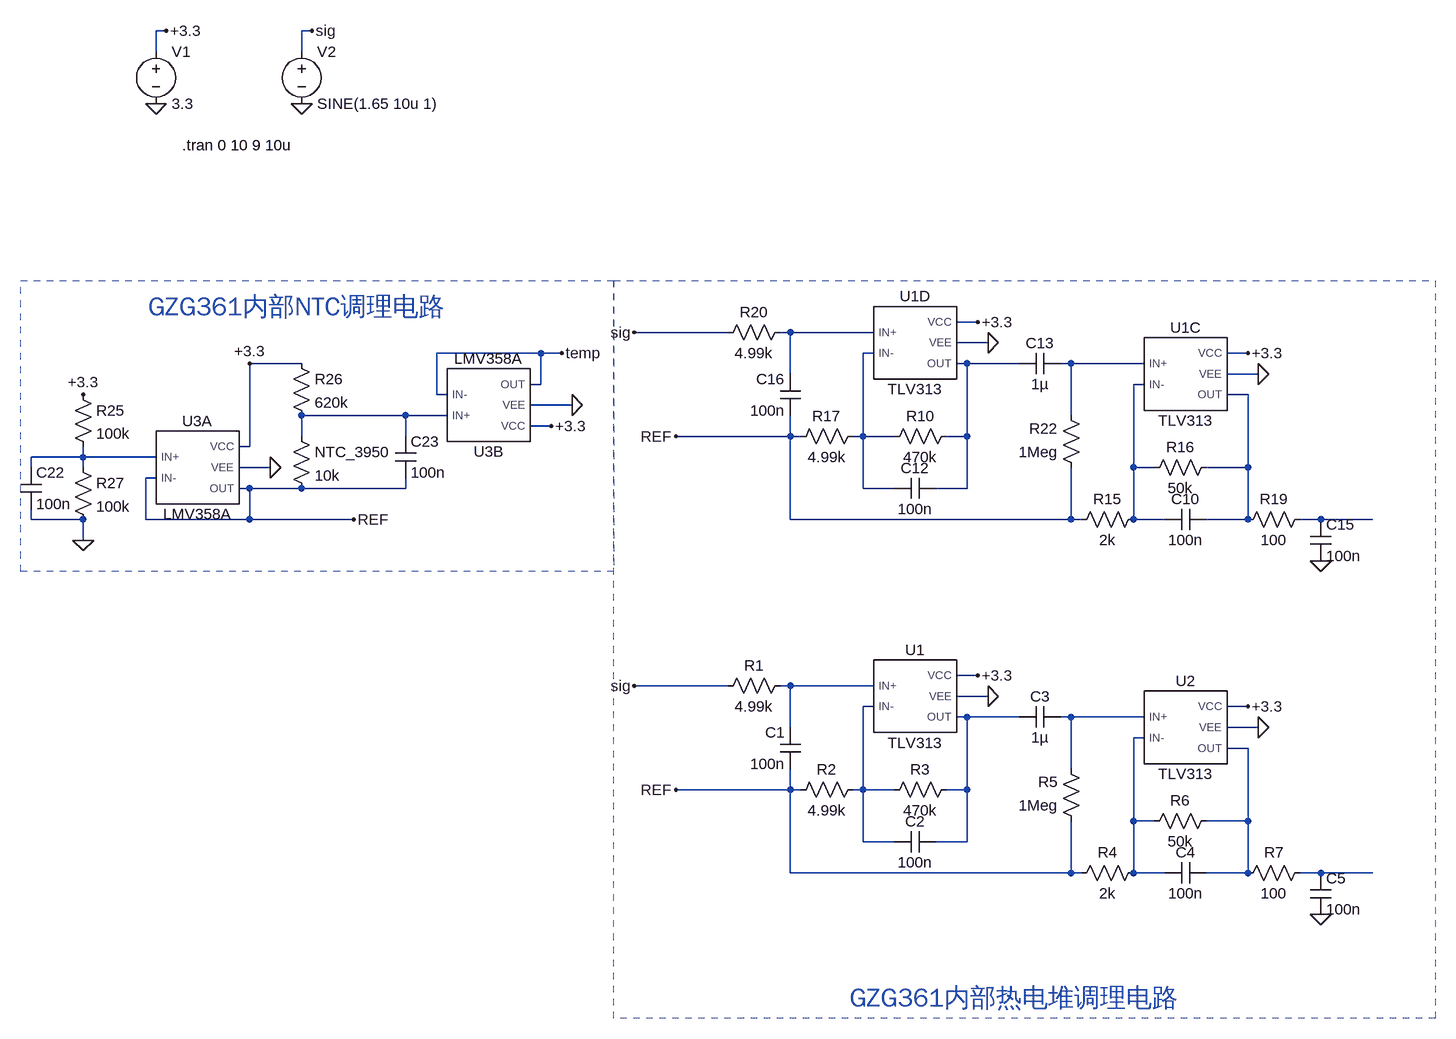
[diagram p0: schematic GZG361调理电路.asc]
GZG361调理电路.asc, the LTspice schematic file:
Version 4.1
SHEET 1 1588 1476
WIRE -384 -304 -400 -304
WIRE -160 -304 -176 -304
WIRE -400 -272 -400 -304
WIRE -176 -272 -176 -304
WIRE 864 144 832 144
WIRE 480 160 336 160
WIRE 576 160 560 160
WIRE 704 160 576 160
WIRE 880 176 832 176
WIRE 192 192 32 192
WIRE 224 192 192 192
WIRE 704 192 688 192
WIRE 1280 192 1248 192
WIRE -176 208 -256 208
WIRE 848 208 832 208
WIRE 928 208 848 208
WIRE 1008 208 992 208
WIRE 1120 208 1008 208
WIRE 576 224 576 160
WIRE 1296 224 1248 224
WIRE 192 240 192 192
WIRE 192 240 176 240
WIRE 1120 240 1104 240
WIRE 32 256 32 192
WIRE 48 256 32 256
WIRE 1280 256 1248 256
WIRE 240 272 176 272
WIRE -16 288 -176 288
WIRE 48 288 -16 288
WIRE 1008 288 1008 208
WIRE 208 304 176 304
WIRE -176 320 -176 288
WIRE -16 320 -16 288
WIRE 576 320 576 288
WIRE 576 320 400 320
WIRE 592 320 576 320
WIRE 688 320 688 192
WIRE 688 320 672 320
WIRE 736 320 688 320
WIRE 848 320 848 208
WIRE 848 320 816 320
WIRE -256 336 -256 208
WIRE -256 336 -272 336
WIRE -512 352 -512 336
WIRE -512 352 -592 352
WIRE -400 352 -512 352
WIRE -592 368 -592 352
WIRE -512 368 -512 352
WIRE -224 368 -272 368
WIRE 1104 368 1104 240
WIRE 1136 368 1104 368
WIRE 1280 368 1280 256
WIRE 1280 368 1216 368
WIRE -400 384 -416 384
WIRE -256 400 -272 400
WIRE -176 400 -256 400
WIRE -16 400 -16 384
WIRE -16 400 -176 400
WIRE 688 400 688 320
WIRE 736 400 688 400
WIRE 848 400 848 320
WIRE 848 400 800 400
WIRE -592 448 -592 432
WIRE -512 448 -592 448
WIRE -416 448 -416 384
WIRE -256 448 -256 400
WIRE -256 448 -416 448
WIRE -96 448 -256 448
WIRE 576 448 576 320
WIRE 1008 448 1008 368
WIRE 1008 448 576 448
WIRE 1024 448 1008 448
WIRE 1104 448 1104 368
WIRE 1152 448 1104 448
WIRE 1280 448 1280 368
WIRE 1280 448 1216 448
WIRE 1392 448 1360 448
WIRE 1472 448 1392 448
WIRE -512 480 -512 448
WIRE 864 688 832 688
WIRE 480 704 336 704
WIRE 576 704 560 704
WIRE 704 704 576 704
WIRE 880 720 832 720
WIRE 704 736 688 736
WIRE 1280 736 1248 736
WIRE 848 752 832 752
WIRE 928 752 848 752
WIRE 1008 752 992 752
WIRE 1120 752 1008 752
WIRE 576 768 576 704
WIRE 1296 768 1248 768
WIRE 1120 784 1104 784
WIRE 1280 800 1248 800
WIRE 1008 832 1008 752
WIRE 576 864 576 832
WIRE 576 864 400 864
WIRE 592 864 576 864
WIRE 688 864 688 736
WIRE 688 864 672 864
WIRE 736 864 688 864
WIRE 848 864 848 752
WIRE 848 864 816 864
WIRE 1104 912 1104 784
WIRE 1136 912 1104 912
WIRE 1280 912 1280 800
WIRE 1280 912 1216 912
WIRE 688 944 688 864
WIRE 736 944 688 944
WIRE 848 944 848 864
WIRE 848 944 800 944
WIRE 576 992 576 864
WIRE 1008 992 1008 912
WIRE 1008 992 576 992
WIRE 1024 992 1008 992
WIRE 1104 992 1104 912
WIRE 1152 992 1104 992
WIRE 1280 992 1280 912
WIRE 1280 992 1216 992
WIRE 1392 992 1360 992
WIRE 1472 992 1392 992
FLAG -512 480 0
FLAG -400 -192 0
FLAG -384 -304 +3.3
FLAG -512 256 +3.3
FLAG -224 368 0
FLAG 224 192 temp
FLAG 208 304 +3.3
FLAG 240 272 0
FLAG -256 208 +3.3
FLAG 864 144 +3.3
FLAG 880 176 0
FLAG 1280 192 +3.3
FLAG 1296 224 0
FLAG 1392 512 0
FLAG -96 448 REF
FLAG 400 320 REF
FLAG -176 -192 0
FLAG -160 -304 sig
FLAG 336 160 sig
FLAG 864 688 +3.3
FLAG 880 720 0
FLAG 1280 736 +3.3
FLAG 1296 768 0
FLAG 1392 1056 0
FLAG 400 864 REF
FLAG 336 704 sig
DATAFLAG -176 448 ""
DATAFLAG -48 288 ""
SYMBOL res -192 192 R0
SYMATTR InstName R26
SYMATTR Value 620k
SYMBOL cap -32 320 R0
SYMATTR InstName C23
SYMATTR Value 100n
SYMBOL res -528 240 R0
SYMATTR InstName R25
SYMATTR Value 100k
SYMBOL res -528 352 R0
SYMATTR InstName R27
SYMATTR Value 100k
SYMBOL cap -608 368 R0
SYMATTR InstName C22
SYMATTR Value 100n
SYMBOL voltage -400 -288 R0
WINDOW 123 0 0 Left 0
WINDOW 39 0 0 Left 0
SYMATTR InstName V1
SYMATTR Value 3.3
SYMBOL res -192 304 R0
SYMATTR InstName NTC_3950
SYMATTR Value 10k
SYMBOL LMV358A -336 368 R0
SYMATTR InstName U3A
SYMBOL LMV358A 112 272 M180
SYMATTR InstName U3B
SYMBOL TLV313 768 176 R0
SYMATTR InstName U1D
SYMBOL res 576 144 R90
WINDOW 0 0 56 VBottom 2
WINDOW 3 32 56 VTop 2
SYMATTR InstName R20
SYMATTR Value 4.99k
SYMBOL cap 592 288 R180
WINDOW 0 24 56 Left 2
WINDOW 3 24 8 Left 2
SYMATTR InstName C16
SYMATTR Value 100n
SYMBOL res 688 304 R90
WINDOW 0 0 56 VBottom 2
WINDOW 3 32 56 VTop 2
SYMATTR InstName R17
SYMATTR Value 4.99k
SYMBOL cap 800 384 R90
WINDOW 0 0 32 VBottom 2
WINDOW 3 32 32 VTop 2
SYMATTR InstName C12
SYMATTR Value 100n
SYMBOL res 832 304 R90
WINDOW 0 0 56 VBottom 2
WINDOW 3 32 56 VTop 2
SYMATTR InstName R10
SYMATTR Value 470k
SYMBOL TLV313 1184 224 R0
SYMATTR InstName U1C
SYMBOL cap 992 192 R90
WINDOW 0 0 32 VBottom 2
WINDOW 3 32 32 VTop 2
SYMATTR InstName C13
SYMATTR Value 1µ
SYMBOL res 1008 464 R270
WINDOW 0 32 56 VTop 2
WINDOW 3 0 56 VBottom 2
SYMATTR InstName R15
SYMATTR Value 2k
SYMBOL res 1024 384 R180
WINDOW 0 36 76 Left 2
WINDOW 3 36 40 Left 2
SYMATTR InstName R22
SYMATTR Value 1Meg
SYMBOL res 1120 384 R270
WINDOW 0 32 56 VTop 2
WINDOW 3 0 56 VBottom 2
SYMATTR InstName R16
SYMATTR Value 50k
SYMBOL cap 1152 464 R270
WINDOW 0 32 32 VTop 2
WINDOW 3 0 32 VBottom 2
SYMATTR InstName C10
SYMATTR Value 100n
SYMBOL res 1264 464 R270
WINDOW 0 32 56 VTop 2
WINDOW 3 0 56 VBottom 2
SYMATTR InstName R19
SYMATTR Value 100
SYMBOL cap 1376 448 R0
SYMATTR InstName C15
SYMATTR Value 100n
SYMBOL voltage -176 -288 R0
WINDOW 123 0 0 Left 0
WINDOW 39 0 0 Left 0
SYMATTR InstName V2
SYMATTR Value SINE(1.65 10u 1)
SYMBOL TLV313 768 720 R0
SYMATTR InstName U1
SYMBOL res 576 688 R90
WINDOW 0 0 56 VBottom 2
WINDOW 3 32 56 VTop 2
SYMATTR InstName R1
SYMATTR Value 4.99k
SYMBOL cap 592 832 R180
WINDOW 0 24 56 Left 2
WINDOW 3 24 8 Left 2
SYMATTR InstName C1
SYMATTR Value 100n
SYMBOL res 688 848 R90
WINDOW 0 0 56 VBottom 2
WINDOW 3 32 56 VTop 2
SYMATTR InstName R2
SYMATTR Value 4.99k
SYMBOL cap 800 928 R90
WINDOW 0 0 32 VBottom 2
WINDOW 3 32 32 VTop 2
SYMATTR InstName C2
SYMATTR Value 100n
SYMBOL res 832 848 R90
WINDOW 0 0 56 VBottom 2
WINDOW 3 32 56 VTop 2
SYMATTR InstName R3
SYMATTR Value 470k
SYMBOL TLV313 1184 768 R0
SYMATTR InstName U2
SYMBOL cap 992 736 R90
WINDOW 0 0 32 VBottom 2
WINDOW 3 32 32 VTop 2
SYMATTR InstName C3
SYMATTR Value 1µ
SYMBOL res 1008 1008 R270
WINDOW 0 32 56 VTop 2
WINDOW 3 0 56 VBottom 2
SYMATTR InstName R4
SYMATTR Value 2k
SYMBOL res 1024 928 R180
WINDOW 0 36 76 Left 2
WINDOW 3 36 40 Left 2
SYMATTR InstName R5
SYMATTR Value 1Meg
SYMBOL res 1120 928 R270
WINDOW 0 32 56 VTop 2
WINDOW 3 0 56 VBottom 2
SYMATTR InstName R6
SYMATTR Value 50k
SYMBOL cap 1152 1008 R270
WINDOW 0 32 32 VTop 2
WINDOW 3 0 32 VBottom 2
SYMATTR InstName C4
SYMATTR Value 100n
SYMBOL res 1264 1008 R270
WINDOW 0 32 56 VTop 2
WINDOW 3 0 56 VBottom 2
SYMATTR InstName R7
SYMATTR Value 100
SYMBOL cap 1376 992 R0
SYMATTR InstName C5
SYMATTR Value 100n
TEXT -360 -128 Left 2 !.tran 0 10 9 10u
TEXT -184 120 Center 4 ;GZG361内部NTC调理电路
TEXT 920 1184 Center 4 ;GZG361内部热电堆调理电路
RECTANGLE Normal 304 528 -608 80 2
RECTANGLE Normal 1568 1216 304 80 2

The netlist it stands for:
* GZG361调理电路.asc
R26 +3.3 N007 620k
C23 N007 REF 100n
R25 +3.3 N008 100k
R27 N008 0 100k
C22 N008 0 100n
V1 +3.3 0 3.3
R§NTC_3950 N007 REF 10k
X§U3A N008 REF +3.3 0 REF LMV358A  ; pins IN+ IN- VCC VEE OUT
X§U3B N007 temp +3.3 0 temp LMV358A  ; pins IN+ IN- VCC VEE OUT
X§U1D N001 N002 +3.3 0 N003 TLV313  ; pins IN+ IN- VCC VEE OUT
R20 N001 sig 4.99k
C16 REF N001 100n
R17 N002 REF 4.99k
C12 N003 N002 100n
R10 N003 N002 470k
X§U1C N004 N005 +3.3 0 N006 TLV313  ; pins IN+ IN- VCC VEE OUT
C13 N004 N003 1µ
R15 REF N005 2k
R22 REF N004 1Meg
R16 N005 N006 50k
C10 N005 N006 100n
R19 N006 N009 100
C15 N009 0 100n
V2 sig 0 SINE(1.65 10u 1)
X§U1 N010 N011 +3.3 0 N012 TLV313  ; pins IN+ IN- VCC VEE OUT
R1 N010 sig 4.99k
C1 REF N010 100n
R2 N011 REF 4.99k
C2 N012 N011 100n
R3 N012 N011 470k
X§U2 N013 N014 +3.3 0 N015 TLV313  ; pins IN+ IN- VCC VEE OUT
C3 N013 N012 1µ
R4 REF N014 2k
R5 REF N013 1Meg
R6 N014 N015 50k
C4 N014 N015 100n
R7 N015 N016 100
C5 N016 0 100n
.tran 0 10 9 10u
* GZG361内部NTC调理电路
* GZG361内部热电堆调理电路
.lib lmv358a.lib
.lib tlv313.lib
.backanno
.end